# EasyEDA Pro project Complete_project.epro, schematic Schematic7
Board Name: EdgeAI; Create Date: 2025-03-24; Page Name: P1; Project Name: 煮茶机; Schematic Name: Schematic7; Update Date: 2025-05-29; Company: 嘉立创EDA; Page Size: A4; Version: V1.0
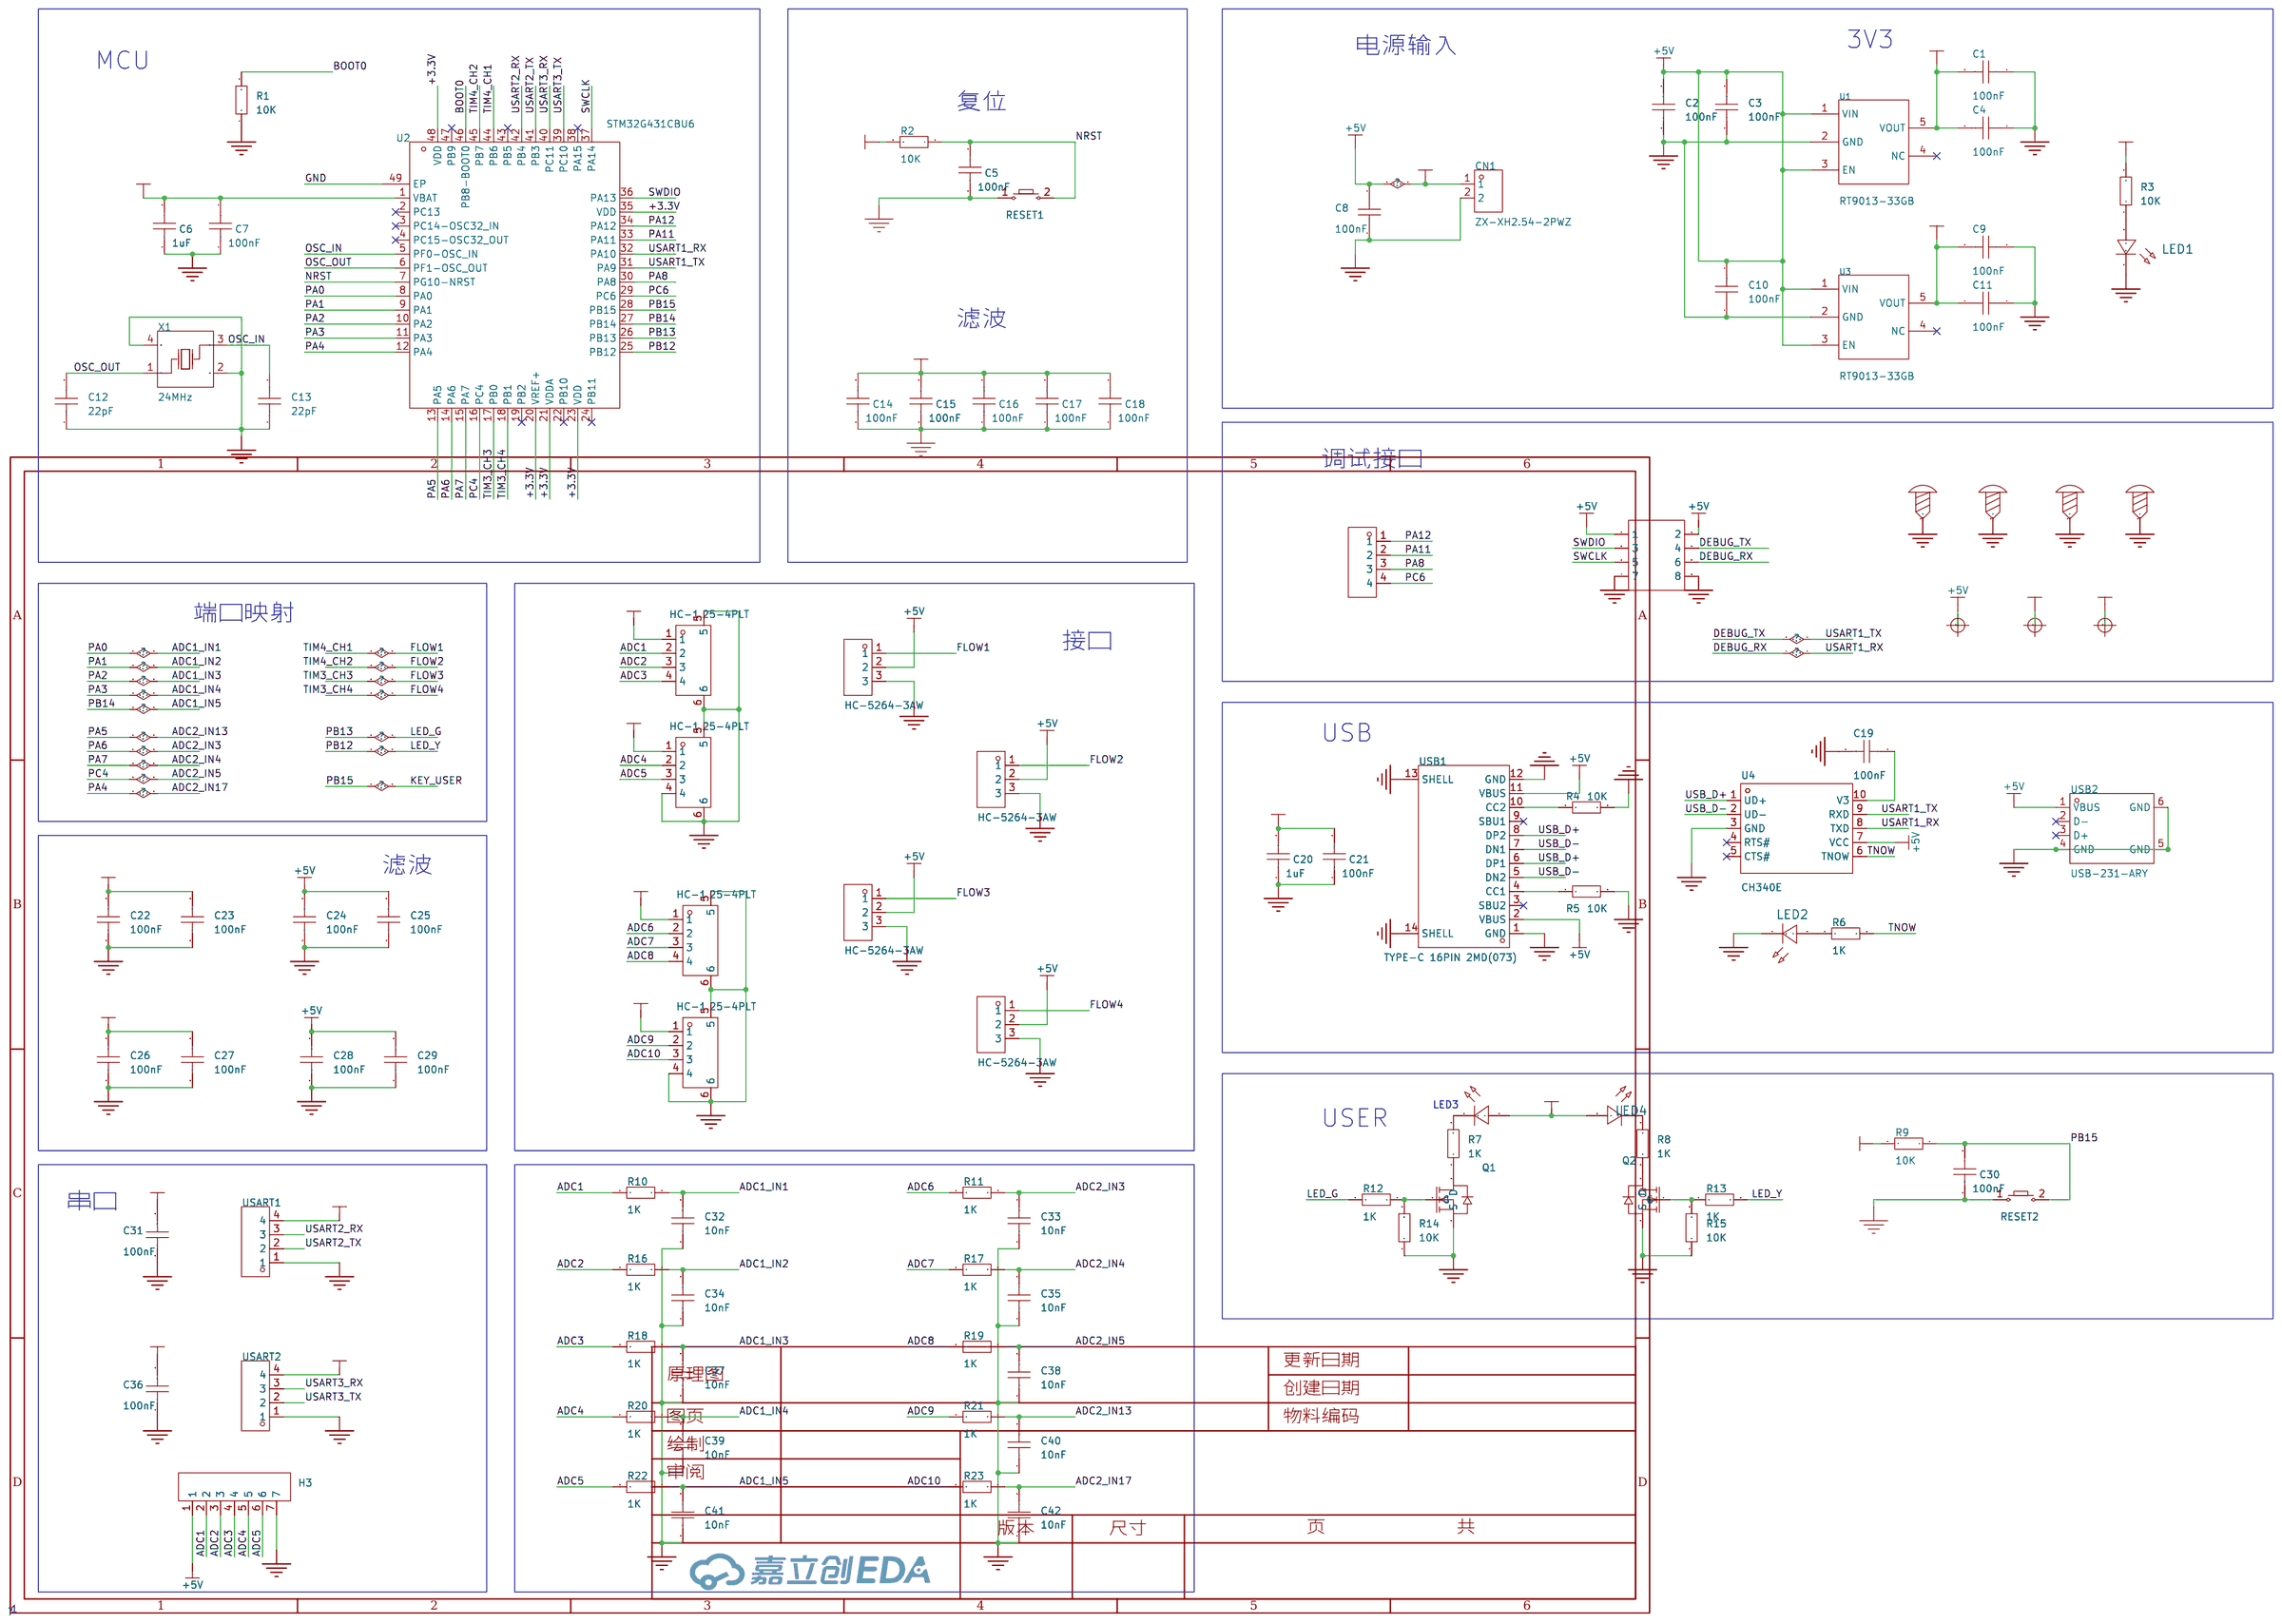
[diagram p11: schematic sheet]

## Parts
ADC1  HC-1.25-4PLT  [CONN-SMD_4P-P1.25_HCTL_HC-1.25-4PLT]
ADC2  HC-1.25-4PLT  [CONN-SMD_4P-P1.25_HCTL_HC-1.25-4PLT]
ADC3  HC-1.25-4PLT  [CONN-SMD_4P-P1.25_HCTL_HC-1.25-4PLT]
ADC4  HC-1.25-4PLT  [CONN-SMD_4P-P1.25_HCTL_HC-1.25-4PLT]
C1  100nF  [C0805]
C2  100nF  [C0805]
C3  100nF  [C0805]
C4  100nF  [C0805]
C5  100nF  [C0805]
C6  1uF  [C0805]
C7  100nF  [C0805]
C8  100nF  [C0805]
C9  100nF  [C0805]
C10  100nF  [C0805]
C11  100nF  [C0805]
C12  22pF  [C0805]
C13  22pF  [C0805]
C14  100nF  [C0805]
C15  100nF  [C0805]
C16  100nF  [C0805]
C17  100nF  [C0805]
C18  100nF  [C0805]
C19  100nF  [C0805]
C20  1uF  [C0805]
C21  100nF  [C0805]
C22  100nF  [C0805]
C23  100nF  [C0805]
C24  100nF  [C0805]
C25  100nF  [C0805]
C26  100nF  [C0805]
C27  100nF  [C0805]
C28  100nF  [C0805]
C29  100nF  [C0805]
C30  100nF  [C0805]
C31  100nF  [C0805]
C32  10nF  [C0805]
C33  10nF  [C0805]
C34  10nF  [C0805]
C35  10nF  [C0805]
C36  100nF  [C0805]
C37  10nF  [C0805]
C38  10nF  [C0805]
C39  10nF  [C0805]
C40  10nF  [C0805]
C41  10nF  [C0805]
C42  10nF  [C0805]
CN1  ZX-XH2.54-2PWZ  [CONN-TH_2P-P2.50_ZX-XH2.54-2PWZ]
DLP1  HC-5264-3AW  [CONN-TH_3P-P2.50_HCTL_HC-5264-3AW]
DLP2  HC-5264-3AW  [CONN-TH_3P-P2.50_HCTL_HC-5264-3AW]
DLP3  HC-5264-3AW  [CONN-TH_3P-P2.50_HCTL_HC-5264-3AW]
DLP4  HC-5264-3AW  [CONN-TH_3P-P2.50_HCTL_HC-5264-3AW]
H1  -  [HDR-TH_4P-P2.54-V-M]
H2  -  [HDR-TH_8P-P2.54-V-F-R2-C4-S2.54-1]
H3  -  [HDR-TH_7P-P2.54-V-M]
LED1  -  [LED_0805]
LED2  -  [LED_0805]
LED3  -  [LED_0805]
LED4  -  [LED_0805]
MARK1  -  [Mark-Point-1mm]  (no BOM)
MARK2  -  [Mark-Point-1mm]  (no BOM)
MARK3  -  [Mark-Point-1mm]  (no BOM)
Q1  -  [SOT-23-3_L2.9-W1.3-P1.90-LS2.4-BR]
Q2  -  [SOT-23-3_L2.9-W1.3-P1.90-LS2.4-BR]
R1  10K  [R0805]
R2  10K  [R0805]
R3  10K  [R0805]
R4  10K  [R0805]
R5  10K  [R0805]
R6  1K  [R0805]
R7  1K  [R0805]
R8  1K  [R0805]
R9  10K  [R0805]
R10  1K  [R0805]
R11  1K  [R0805]
R12  1K  [R0805]
R13  1K  [R0805]
R14  10K  [R0805]
R15  10K  [R0805]
R16  1K  [R0805]
R17  1K  [R0805]
R18  1K  [R0805]
R19  1K  [R0805]
R20  1K  [R0805]
R21  1K  [R0805]
R22  1K  [R0805]
R23  1K  [R0805]
RESET1  -  [SW_PB2_A1]
RESET2  -  [SW_PB2_A1]
SCREW1  -  [M2螺丝]
SCREW2  -  [M2螺丝]
SCREW3  -  [M2螺丝]
SCREW4  -  [M2螺丝]
U1  RT9013-33GB  [SOT-23-5_L3.0-W1.7-P0.95-LS2.8-BL]
U2  STM32G431CBU6  [UFQFPN-48_L7.0-W7.0-P0.50-BL-EP]
U3  RT9013-33GB  [SOT-23-5_L3.0-W1.7-P0.95-LS2.8-BL]
U4  CH340E  [MSOP-10_L3.0-W3.0-P0.50-LS5.0-BL]
USART1  ZX-XH2.54-4PWZ-Y  [CONN-TH_4P-P2.50_ZX-XH2.54-4PWZ-Y]
USART2  ZX-XH2.54-4PWZ-Y  [CONN-TH_4P-P2.50_ZX-XH2.54-4PWZ-Y]
USB1  TYPE-C 16PIN 2MD(073)  [USB-C-SMD_TYPE-C-6PIN-2MD-073]
USB2  USB-231-ARY  [USB-A-TH_USB-231-ARY]
X1  24MHz  [CRYSTAL-SMD_4P-L3.2-W2.5-BL]

## Library data of the parts
ADC1-ADC4 = HC-1.25-4PLT: 插针结构:1x4P;间距:1.25mm;安装方式:立贴;参考系列:-;总PIN数:4P;排数:1;每排PIN数:4;行距:-;额定电流:2A;触头材质:黄铜;触头镀层:锡;工作温度范围:-25℃~+85℃;; LCSC Part Name: 1x4P 间距:1.25mm 立贴; Supplier Part: C2845390; Manufacturer: HCTL(华灿天禄); Supplier Footprint: SMD,P=1.25mm; JLCPCB Part Class: 扩展库; Datasheet: https://atta.szlcsc.com/upload/public/pdf/source/20230707/8E5913B5A3195C18F5EE12EA4CB86B82.pdf; Supplier: LCSC; Pins Structure: 1x4P; Pitch: 1.25mm; Mounting Style: 立贴; Number of Pins: 4P; Number of Rows: 1; Number of PINs Per Row: 4; Current Rating (Max): 2A; Contact Material: 黄铜; Contact Plating: 锡; Operating Temperature Range: -25℃~+85℃
C1-C21 C30-C42 = CAP_0805: Supplier Footprint: 0805
C22-C29 = CAP_0603: Supplier Footprint: 0603
CN1 = ZX-XH2.54-2PWZ: 插针结构:1x2P;间距:2.54mm;安装方式:弯插;参考系列:XH;总PIN数:2P;排数:1;每排PIN数:2;行距:-;额定电流:3A;触头材质:黄铜;触头镀层:锡;工作温度范围:-25℃~+85℃;; Supplier Part: C7429641; Manufacturer: Megastar(兆星); Supplier Footprint: 弯插,P=2.54mm; JLCPCB Part Class: 扩展库; Datasheet: https://atta.szlcsc.com/upload/public/pdf/source/20230619/56AE8F2E01CDFEAA97FC89B5ED558AB5.pdf; Supplier: LCSC; Pins Structure: 1x2P; Pitch: 2.54mm; Mounting Style: 弯插; Reference Series: XH; Number of Pins: 2P; Number of Rows: 1; Number of PINs Per Row: 2; Current Rating (Max): 3A; Contact Material: 黄铜; Contact Plating: 锡; Operating Temperature Range: -25℃~+85℃
DLP1-DLP4 = HC-5264-3AW: 插针结构:1x3P;间距:2.5mm;安装方式:弯插;参考系列:-;总PIN数:3P;排数:1;每排PIN数:3;行距:-;额定电流:3A;触头材质:黄铜;触头镀层:锡;工作温度范围:-25℃~+85℃;; LCSC Part Name: 1x3P 间距:2.5mm 弯插; Supplier Part: C2845826; Manufacturer: HCTL(华灿天禄); Supplier Footprint: 弯插,P=2.5mm; JLCPCB Part Class: 扩展库; Datasheet: https://atta.szlcsc.com/upload/public/pdf/source/20231019/7C36622803850C43F3C11A8612AA539D.pdf; Supplier: LCSC; Pins Structure: 1x3P; Pitch: 2.5mm; Mounting Style: 弯插; Number of Pins: 3P; Number of Rows: 1; Number of PINs Per Row: 3; Current Rating (Max): 3A; Contact Material: 黄铜; Contact Plating: 锡; Operating Temperature Range: -25℃~+85℃
H1 = HDR-M_2.54_1x4P: Supplier Part: C492403; Supplier Footprint: 插件
H2 = HDR-F_2.54_2x4: Supplier Part: C92271; Supplier Footprint: 插件
H3 = HDR-M_2.54_1x7P: Supplier Part: C492406; Supplier Footprint: 插件
LED1 LED2 LED4 = LED_0805-R: Supplier Footprint: 0805
LED3 = LED_0805-G: Supplier Footprint: 0805
MARK1-MARK3 = Mark-Point: Mark点
Q1 Q2 = AO3400A_N: 类型:N沟道;漏源电压(Vdss):30V;连续漏极电流(Id):5.2A;功率(Pd):1W;导通电阻(RDS(on)@Vgs,Id):35mΩ@10V,5A;阈值电压(Vgs(th)@Id):1.5V@250μA;; Supplier Footprint: SOT-23; Supplier Part: C700953
R1-R23 = Res_0805: Supplier Footprint: 0805
RESET1 RESET2 = Key_SMD_3x4x2: Supplier Footprint: SMD
SCREW1-SCREW4 = M2螺丝: Supplier Footprint: 插件
U1 U3 = RT9013-33GB: 输出类型:固定;输出极性:正;最大输入电压:5.5V;输出电压:3.3V;输出电流:500mA;电源纹波抑制比(PSRR):50dB@(10kHz);; LCSC Part Name: 输入5.5V 输出3.3V 500mA; Supplier Part: C47773; Manufacturer: RICHTEK(立锜); Supplier Footprint: SOT-23-5; JLCPCB Part Class: 扩展库; Datasheet: https://atta.szlcsc.com/upload/public/pdf/source/20150504/1457707282459.pdf; Supplier: LCSC; Output Type: 固定; Output Polarity: 正; Number of Outputs: 1; Maximum Input Voltage: 5.5V; Output Voltage: 3.3V; Dropout Voltage: 400mV@(500mA); Quiescent Current (Ground Current): 50uA; Output Current: 500mA; Power Supply Rejection Ratio (PSRR): 50dB@(10kHz); Operating Temperature: -40℃~+85℃
U2 = STM32G431CBU6: CPU内核:ARM-M系列;程序存储容量:128KB;RAM总容量:32KB;GPIO端口数量:42;工作电压范围:1.71V~3.6V;CPU最大主频:170MHz;程序存储器类型:FLASH;; Supplier Part: C529356; Manufacturer: ST(意法半导体); Supplier Footprint: UFQFPN-48(7x7); JLCPCB Part Class: 扩展库; Datasheet: https://atta.szlcsc.com/upload/public/pdf/source/20200511/C529354_7C66CF00837B904D0C15DCE45B69418C.pdf; Supplier: LCSC; CPU Core: ARM-M系列; Program Storage Size: 128KB; RAM Size: 32KB; GPIO Ports Number: 42; Operating Voltage Range: 1.71V~3.6V; CPU Maximum Speed: 170MHz; Program Memory Type: FLASH; Operating Temperature Range: -40℃~+85℃; ADC (Bit): 12bit; DAC (Bit): 12bit; Peripheral/Function: DMA；PWM; Watchdog: 有; Infrared Data Association: 有; Low-Voltage Detect: 有; Direct Memory Access: 有; Internal Oscillator: 有
U4 = CH340E: 应用功能:收发器;接口协议:USB 2.0;数据速率:2Mbps;; LCSC Part Name: USB转串口芯片CH340; Supplier Part: C99652; Manufacturer: WCH(南京沁恒); Supplier Footprint: MSOP-10; JLCPCB Part Class: Extended Part; Datasheet: https://atta.szlcsc.com/upload/public/pdf/source/20240313/4FD4567B6A986AE079C4960D6CEBDDB5.pdf; Supplier: LCSC; Applications Function: 收发器; Protocol: USB 2.0; Supply Voltage: 3.3V；5V; Data Rate: 2Mbps
USART1 USART2 = ZX-XH2.54-4PWZ-Y: 插针结构:1x4P;间距:2.54mm;安装方式:弯插;参考系列:XH;总PIN数:4P;排数:1;每排PIN数:4;触头材质:铜合金;触头镀层:锡;工作温度范围:-25℃~+85℃;; LCSC Part Name: 1x4P 间距:2.54mm 弯插 系列:XH; Supplier Part: C22388631; Manufacturer: Megastar(兆星); Supplier Footprint: 弯插,P=2.54mm; JLCPCB Part Class: 扩展库; Datasheet: https://atta.szlcsc.com/upload/public/pdf/source/20240429/5637F708FFDFB25A638AA785AB789433.pdf; Supplier: LCSC; Pins Structure: 1x4P; Pitch: 2.54mm; Mounting Style: 弯插; Reference Series: XH; Number of Pins: 4P; Number of Rows: 1; Number of PINs Per Row: 4; Contact Material: 铜合金; Contact Plating: 锡; Operating Temperature Range: -25℃~+85℃; Rated Voltage (Max): 250V; Plastic Material: PA66; Colour: 黄色
USB1 = TYPE-C 16PIN 2MD(073): 连接器类型:Type-C;标准:-;公母:母;触点数量:16P;端口数量:1;安装方式:卧贴;额定电流 - 电源:5A;工作温度范围:-25℃~+85℃;; LCSC Part Name: Type-C 母 卧贴 带定位柱 不锈钢外壳 2次模顶; Supplier Part: C2765186; Manufacturer: SHOU HAN(首韩); Supplier Footprint: SMD; JLCPCB Part Class: Extended Part; Datasheet: https://atta.szlcsc.com/upload/public/pdf/source/20211123/39B17C16241EAC15C5E277BDA434118E.pdf; Supplier: LCSC; Connector Type: Type-C; Gender: 母; Number of Contacts: 16P; Number of Ports: 1; Mounting Style: 卧贴; Current Rating - Power (Max): 5A; Operating Temperature Range: -25℃~+85℃
USB2 = USB-231-ARY: 连接器类型:Type-A;标准:USB 2.0;公母:母;端口数量:1;触点数量:4P;安装方式:弯插;额定电流 - 电源:1.5A;触头材质:-;触头镀层:-;工作温度范围:-20℃~+70℃;焊接温度(最大值):260℃;; LCSC Part Name: Type-A 母 弯插; Supplier Part: C720525; Manufacturer: XUNPU(讯普); Supplier Footprint: 插件; JLCPCB Part Class: 扩展库; Datasheet: https://atta.szlcsc.com/upload/public/pdf/source/20200810/C720525_A4C9C15D608FF9239C9C137FD959DB52.pdf; Supplier: LCSC; Connector Type: Type-A; Standard: USB 2.0; Gender: 母; Number of Ports: 1; Number of Contacts: 4P; Mounting Style: 弯插; Current Rating - Power (Max): 1.5A; Operating Temperature Range: -20℃~+70℃; Soldering Temperature(Max): 260℃
X1 = X322525MOB4SI: 晶振类型:贴片晶振;频率:25MHz;常温频差:±10ppm;负载电容:12pF;频率稳定度(全温):±20ppm;; LCSC Part Name: 25MHz ±10ppm 12pF; Supplier Part: C9006; Manufacturer: YXC(扬兴晶振); Supplier Footprint: SMD3225-4P; JLCPCB Part Class: Basic Part; Datasheet: https://atta.szlcsc.com/upload/public/pdf/source/20240329/19D5F850207469550BEB00D7DFEDBC7A.pdf; Supplier: LCSC; Crystal Type: 贴片晶振; Normal temperature Frequency Tolerance: ±10ppm; Load Capacitor: 12pF; Frequency Stability(Full temperature range): ±20ppm; Operating Temperature: -40℃~+85℃

## Nets
+3.3V: C1.2 C4.2 C6.2 C7.2 C14.2 C15.2 C16.2 C17.2 C18.2 LED3.2(A) LED4.2(A) MARK2.1 R2.2 R3.2 R9.2 U1.5(VOUT) U2.1(VBAT) U2.20(VREF+) U2.21(VDDA) U2.23(VDD) U2.35(VDD) U2.48(VDD)
+3.3VA: ADC1.1 ADC2.1 ADC3.1 ADC4.1 C9.2 C11.2 C22.2 C23.2 C26.2 C27.2 MARK3.1 U3.5(VOUT)
+5V: C2.2 C3.2 C8.2 C10.2 C20.2 C21.2 C24.2 C25.2 C28.2 C29.2 C31.2 C36.2 CN1.1 DLP1.2 DLP2.2 DLP3.2 DLP4.2 H2.1 H2.2 H3.1 MARK1.1 U1.1(VIN) U1.3(EN) U3.1(VIN) U3.3(EN) U4.7(VCC) USART1.4 USART2.4 USB1.2(VBUS) USB1.11(VBUS) USB2.1(VBUS)
GND: ADC1.5 ADC1.6 ADC2.4 ADC2.5 ADC2.6 ADC3.5 ADC3.6 ADC4.4 ADC4.5 ADC4.6 C1.1 C2.1 C3.1 C4.1 C5.2 C6.1 C7.1 C8.1 C9.1 C10.1 C11.1 C12.1 C13.1 C14.1 C15.1 C16.1 C17.1 C18.1 C19.2 C20.1 C21.1 C22.1 C23.1 C24.1 C25.1 C26.1 C27.1 C28.1 C29.1 C30.2 C31.1 C32.1 C33.1 C34.1 C35.1 C36.1 C37.1 C38.1 C39.1 C40.1 C41.1 C42.1 CN1.2 DLP1.3 DLP2.3 DLP3.3 DLP4.3 H2.7 H2.8 H3.7 LED1.1(C) LED2.1(C) Q1.2(S) Q2.2(S) R1.1 R4.2 R5.2 R14.1 R15.1 RESET1.1 RESET2.1 SCREW1.1 SCREW2.1 SCREW3.1 SCREW4.1 U1.2(GND) U2.49(EP) U3.2(GND) U4.3(GND) USART1.1 USART2.1 USB1.1(GND) USB1.12(GND) USB1.13(SHELL) USB1.14(SHELL) USB2.4(GND) USB2.5(GND) USB2.6(GND) X1.2(GND) X1.4(GND)
ADC1: ADC1.2 H3.2 R10.1
ADC1_IN1: C32.2 R10.2 U2.8(PA0)
ADC1_IN2: C34.2 R16.2 U2.9(PA1)
ADC1_IN3: C37.2 R18.2 U2.10(PA2)
ADC1_IN4: C39.2 R20.2 U2.11(PA3)
ADC1_IN5: C41.2 R22.2 U2.27(PB14)
ADC2: ADC1.3 H3.3 R16.1
ADC2_IN3: C33.2 R11.2 U2.14(PA6)
ADC2_IN4: C35.2 R17.2 U2.15(PA7)
ADC2_IN5: C38.2 R19.2 U2.16(PC4)
ADC2_IN13: C40.2 R21.2 U2.13(PA5)
ADC2_IN17: C42.2 R23.2 U2.12(PA4)
ADC3: ADC1.4 H3.4 R18.1
ADC4: ADC2.2 H3.5 R20.1
ADC5: ADC2.3 H3.6 R22.1
ADC6: ADC3.2 R11.1
ADC7: ADC3.3 R17.1
ADC8: ADC3.4 R19.1
ADC9: ADC4.2 R21.1
ADC10: ADC4.3 R23.1
BOOT0: R1.2 U2.46(PB8-BOOT0)
DEBUG_RX: H2.6 U2.32(PA10) U4.8(TXD)
DEBUG_TX: H2.4 U2.31(PA9) U4.9(RXD)
FLOW1: DLP1.1 U2.44(PB6)
FLOW2: DLP2.1 U2.45(PB7)
FLOW3: DLP3.1 U2.17(PB0)
FLOW4: DLP4.1 U2.18(PB1)
KEY_USER: C30.1 R9.1 RESET2.2 U2.28(PB15)
LED_G: R12.2 U2.26(PB13)
LED_Y: R13.2 U2.25(PB12)
NRST: C5.1 R2.1 RESET1.2 U2.7(PG10-NRST)
OSC_IN: C13.2 U2.5(PF0-OSC_IN) X1.3(OSC2)
OSC_OUT: C12.2 U2.6(PF1-OSC_OUT) X1.1(OSC1)
PA8: H1.3 U2.30(PA8)
PA11: H1.2 U2.33(PA11)
PA12: H1.1 U2.34(PA12)
PC6: H1.4 U2.29(PC6)
SWCLK: H2.5 U2.37(PA14)
SWDIO: H2.3 U2.36(PA13)
TNOW: R6.2 U4.6(TNOW)
USART2_RX: U2.42(PB4) USART1.3
USART2_TX: U2.41(PB3) USART1.2
USART3_RX: U2.40(PC11) USART2.3
USART3_TX: U2.39(PC10) USART2.2
USB_D+: U4.1(UD+) USB1.6(DP1) USB1.8(DP2)
USB_D-: U4.2(UD-) USB1.5(DN2) USB1.7(DN1)
$1N4623: R5.1 USB1.4(CC1)
$1N4687: R4.1 USB1.10(CC2)
$1N4832: C19.1 U4.10(V3)
$1N4971: LED2.2(A) R6.1
$1N9916: Q1.1(G) R12.1 R14.2
$1N10081: Q2.1(G) R13.1 R15.2
$1N10151: Q1.3(D) R7.1
$1N10201: Q2.3(D) R8.1
Net-(LED1-2): LED1.2(A) R3.1
Net-(LED3-1): LED3.1(C) R7.2
Net-(LED4-1): LED4.1(C) R8.2

Not connected (* = marked no-connect by the designer): U1 4(NC)*; U2 2(PC13)* 3(PC14-OSC32_IN)* 4(PC15-OSC32_OUT)* 19(PB2)* 22(PB10)* 24(PB11)* 38(PA15)* 43(PB5)* 47(PB9)*; U3 4(NC)*; U4 4(RTS#)* 5(CTS#)*; USB1 3(SBU2)* 9(SBU1)*; USB2 2(D-)* 3(D+)*

## Notes on the sheet
- 电源输入
- 3V3
- MCU
- 复位
- 滤波
- 调试接口
- 端口映射
- 接口
- USB
- 滤波
- USER
- 串口
